# EAGLE schematic kotolna (EAGLE 9.0.1)
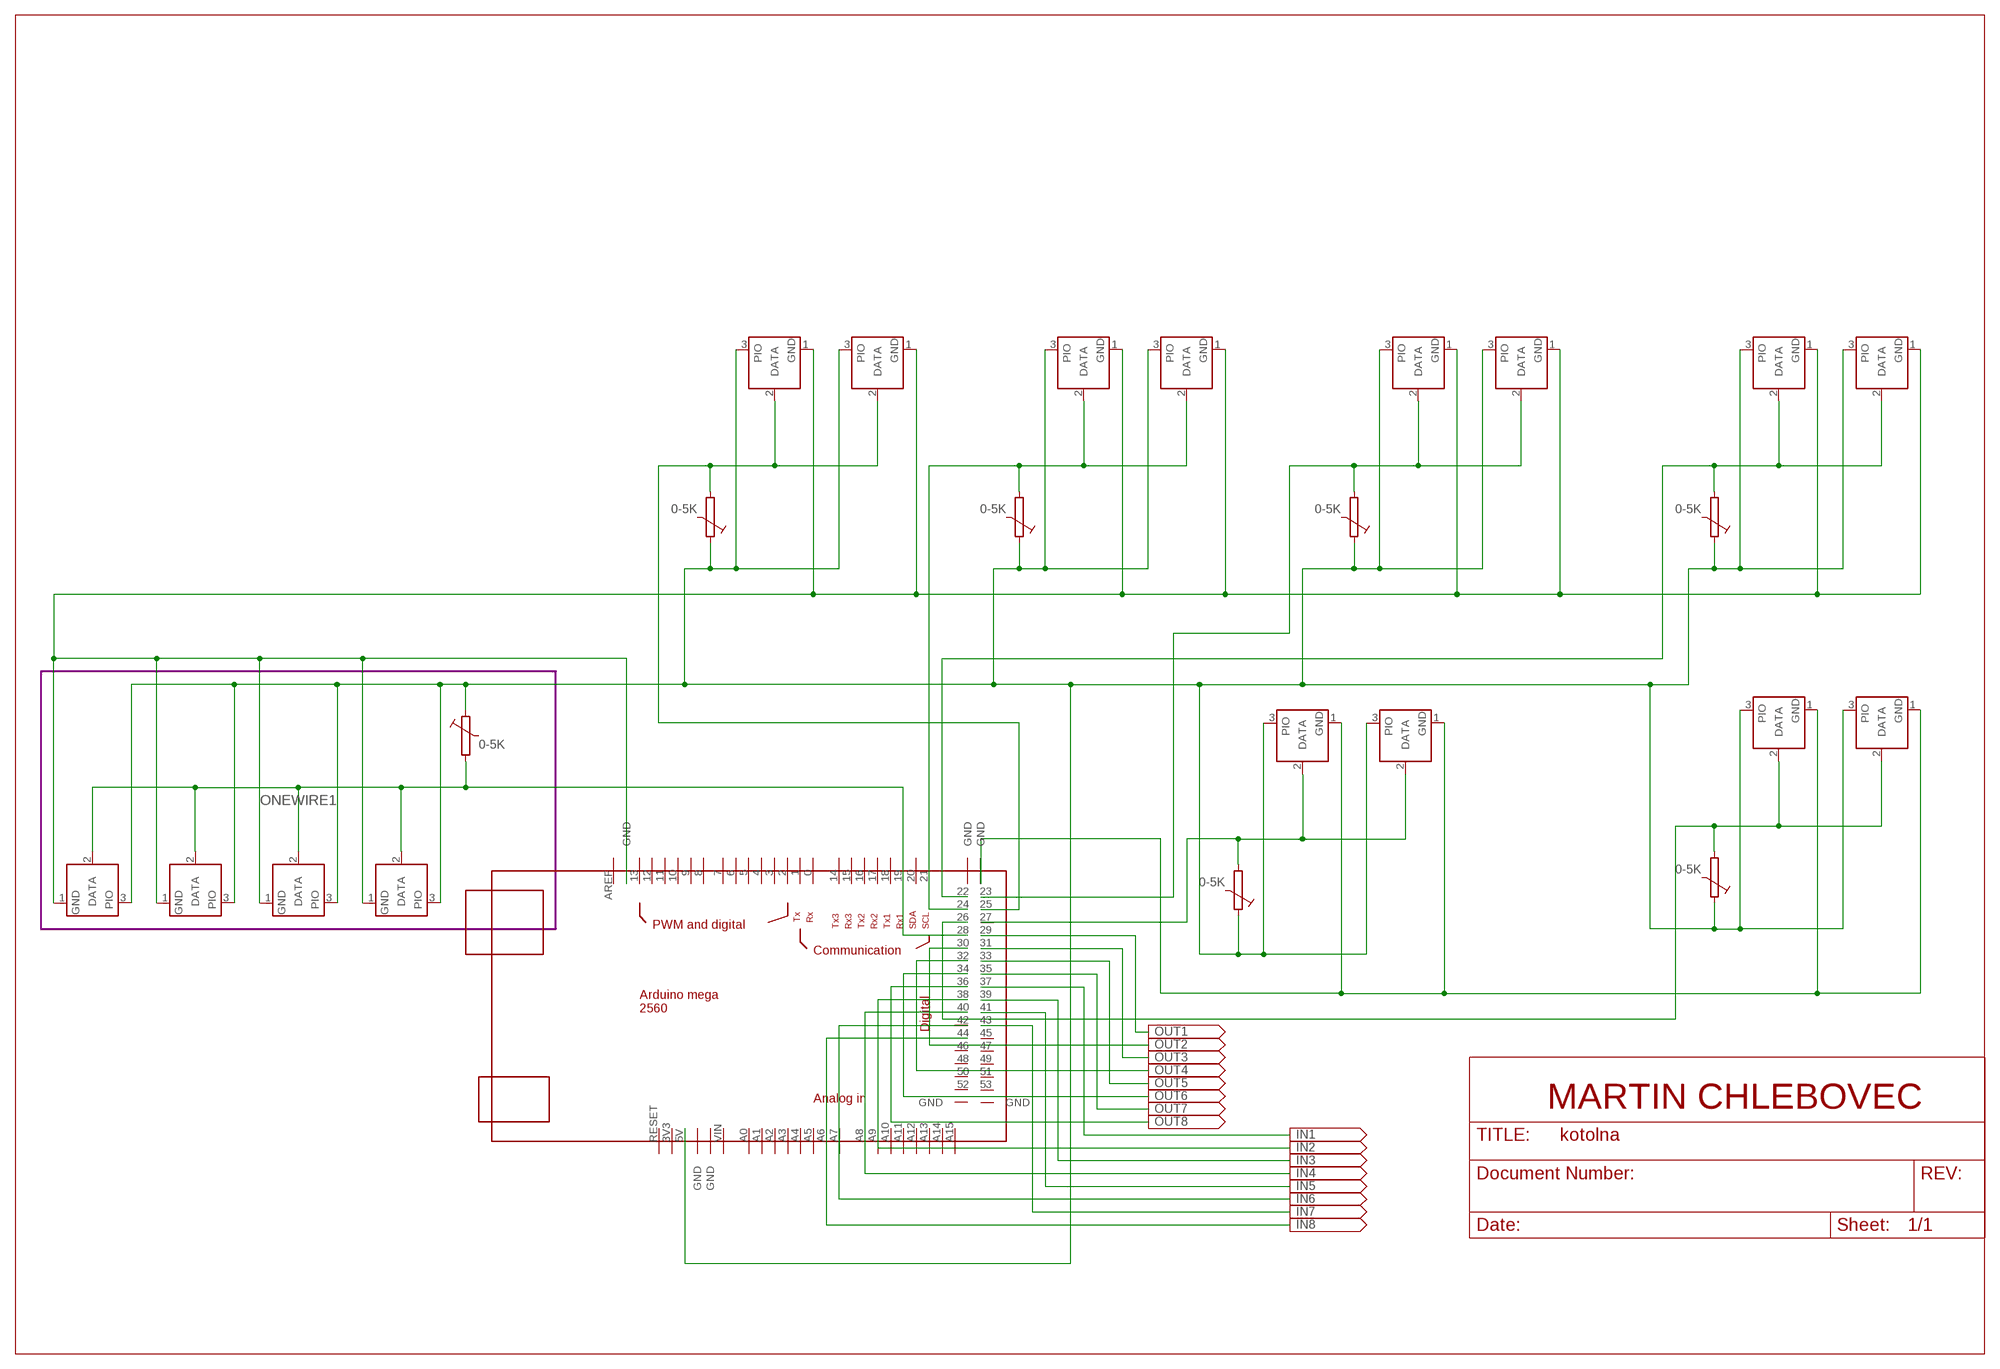
[diagram p0: schematic, sheet 1]

## Parts
IC1  DS2405  [TO92-]
IC2  DS2405  [TO92-]
IC3  DS2405  [TO92-]
IC4  DS2405  [TO92-]
IC5  DS2405  [TO92-]
IC6  DS2405  [TO92-]
IC7  DS2405  [TO92-]
IC8  DS2405  [TO92-]
IC9  DS2405  [TO92-]
IC10  DS2405  [TO92-]
IC11  DS2405  [TO92-]
IC12  DS2405  [TO92-]
IC13  DS2405  [TO92-]
IC14  DS2405  [TO92-]
IC15  DS2405  [TO92-]
IC16  DS2405  [TO92-]
U$1  MEGA_DEVICE  [MEGAOUTLINE]

## Module instances
ONEWIRE1 = ONEWIRE

## Nets
N$1: IC2.2(DATA) IC3.2(DATA) IC6.2(DATA) IC7.2(DATA) U$1.28
N$2: U$1.29
N$3: IC13.2(DATA) IC14.2(DATA) U$1.26
N$4: U$1.31
N$5: U$1.33
N$6: IC1.2(DATA) IC4.2(DATA) U$1.22
N$7: IC5.2(DATA) IC8.2(DATA) U$1.23
N$8: U$1.35
N$9: IC15.2(DATA) IC16.2(DATA) U$1.27
N$10: U$1.37
N$11: IC9.2(DATA) IC10.2(DATA) U$1.24
N$12: IC13.1(GND) IC14.1(GND) IC15.1(GND) IC16.1(GND) U$1.GND@5(GND)
N$13: IC1.3(PIO) IC2.3(PIO) IC3.3(PIO) IC4.3(PIO) IC5.3(PIO) IC6.3(PIO) IC7.3(PIO) IC8.3(PIO) IC9.3(PIO) IC10.3(PIO) IC11.3(PIO) IC12.3(PIO) IC13.3(PIO) IC14.3(PIO) IC15.3(PIO) IC16.3(PIO) U$1.5V
N$14: IC11.2(DATA) IC12.2(DATA) U$1.25
N$15: U$1.30
N$16: U$1.32
N$17: U$1.34
N$18: U$1.36
N$19: U$1.38
N$20: U$1.39
N$21: U$1.40
N$22: U$1.41
N$23: U$1.42
N$24: U$1.43
N$25: IC1.1(GND) IC2.1(GND) IC3.1(GND) IC4.1(GND) IC5.1(GND) IC6.1(GND) IC7.1(GND) IC8.1(GND) IC9.1(GND) IC10.1(GND) IC11.1(GND) IC12.1(GND) U$1.GND@1(GND)
N$26: U$1.44
Unconnected: U$1.0 U$1.1 U$1.2 U$1.3 U$1.3V3 U$1.4 U$1.5 U$1.6 U$1.7 U$1.8 U$1.9 U$1.10 U$1.11 U$1.12 U$1.13 U$1.14 U$1.15 U$1.16 U$1.17 U$1.18 U$1.19 U$1.20 U$1.21 U$1.45 U$1.46 U$1.47 U$1.48 U$1.49 U$1.50 U$1.51 U$1.52 U$1.53 U$1.A0 U$1.A1 U$1.A2 U$1.A3 U$1.A4 U$1.A5 U$1.A6 U$1.A7 U$1.A8 U$1.A9 U$1.A10 U$1.A11 U$1.A12 U$1.A13 U$1.A14 U$1.A15 U$1.AREF U$1.GND@2(GND) U$1.GND@3(GND) U$1.GND@4(GND) U$1.GND@6(GND) U$1.GND@7(GND) U$1.RESET U$1.VIN

## Notes on the sheet
- 0-5K | 0-5K | 0-5K | 0-5K
- 0-5K
- 0-5K
- 0-5K
- MARTIN CHLEBOVEC

## Library data of the parts
IC1-IC16 = maxim:DS2405: Addressable Switch DALLAS Semiconductor; MF: DALLAS SEMICONDUCTOR; MPN: DS2405; OC_FARNELL: 1188025; OC_NEWARK: 06F4645
U$1 = ArduinoMegaOutline:MEGA_DEVICE: mega card as device

## Module ONEWIRE
Ports: 

### Library data of the parts